# EAGLE design schematic (EAGLE 6.4)
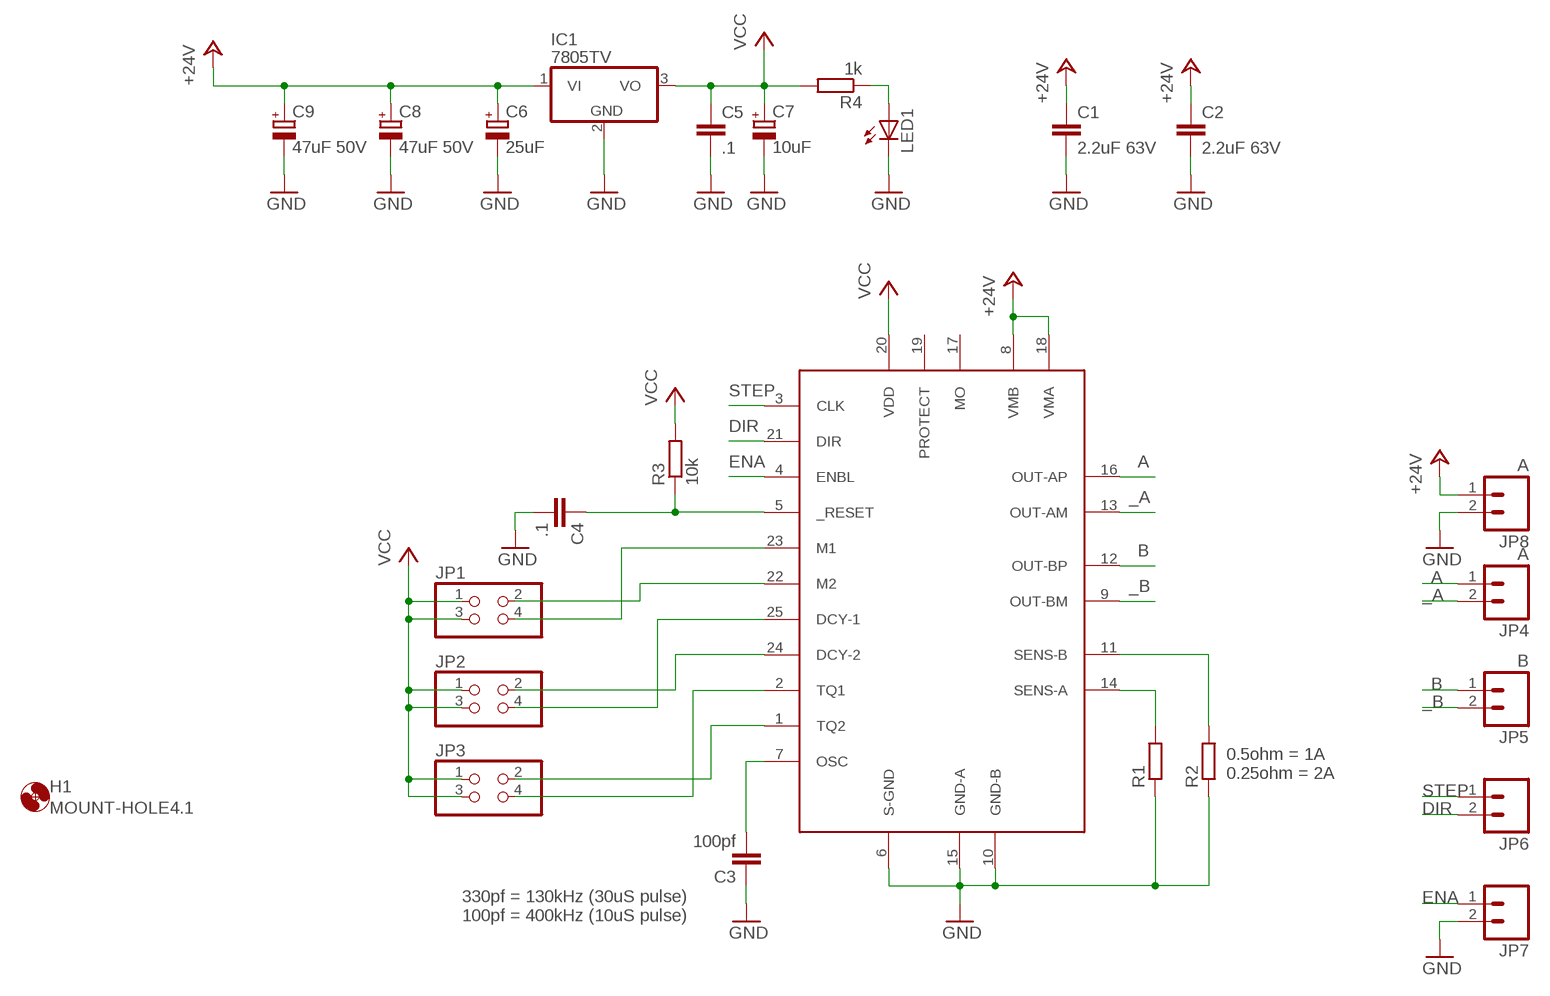
[diagram p0: schematic, sheet 1]

## Parts
C1  2.2uF 63V  C-EU225-108X268  [C225-108X268]
C2  2.2uF 63V  C-EU225-108X268  [C225-108X268]
C3  100pf  C-EUC0805K  [C0805K]
C4  .1  C-EUC0805K  [C0805K]
C5  .1  C-EUC0805K  [C0805K]
C6  25uF  CPOL-EUE2.5-5  [E2,5-5]
C7  10uF  CPOL-EUE2.5-5  [E2,5-5]
C8  47uF 50V  CPOL-EUE2.5-5  [E2,5-5]
C9  47uF 50V  CPOL-EUE2.5-5  [E2,5-5]
H1  MOUNT-HOLE4.1  [4,1]
IC1  7805TV  [TO220V]
JP1  PINHD-2X2  [2X02]
JP2  PINHD-2X2  [2X02]
JP3  PINHD-2X2  [2X02]
JP4  A  M02PTH4  [1X02_XTRA_BIG]
JP5  B  M02PTH4  [1X02_XTRA_BIG]
JP6  M02POGO_PIN_HOLES_ONLY  [1X02_PP_HOLES_ONLY]
JP7  M02POGO_PIN_HOLES_ONLY  [1X02_PP_HOLES_ONLY]
JP8  A  M02PTH4  [1X02_XTRA_BIG]
LED1  TLLG4400  [LED3MM]
R1  R-EU_0617/17  [0617/17]
R2  R-EU_0617/17  [0617/17]
R3  10k  R-EU_R0805  [R0805]
R4  1k  R-EU_R0805  [R0805]
U$1  TB6560-H  [ZIP25-H]

## Nets
+24V: C1.1 C2.1 C6.+ C8.+ C9.+ IC1.1(VI) JP8.1 U$1.8(VMB) U$1.18(VMA)
_A: JP4.2 U$1.13(OUT-AM)
_B: JP5.2 U$1.9(OUT-BM)
A: JP4.1 U$1.16(OUT-AP)
B: JP5.1 U$1.12(OUT-BP)
DIR: JP6.2 U$1.21(DIR)
ENA: JP7.1 U$1.4(ENBL)
GND: C1.2 C2.2 C3.1 C4.2 C5.2 C6.- C7.- C8.- C9.- IC1.2(GND) JP7.2 JP8.2 LED1.K(C) R1.1 R2.1 U$1.6(S-GND) U$1.10(GND-B) U$1.15(GND-A)
N$1: R1.2 U$1.14(SENS-A)
N$2: R2.2 U$1.11(SENS-B)
N$3: JP3.2 U$1.1(TQ2)
N$4: JP3.4 U$1.2(TQ1)
N$5: JP2.2 U$1.24(DCY-2)
N$6: JP2.4 U$1.25(DCY-1)
N$7: JP1.2 U$1.22(M2)
N$8: JP1.4 U$1.23(M1)
N$11: C4.1 R3.1 U$1.5(_RESET)
N$12: C3.2 U$1.7(OSC)
N$13: LED1.A R4.1
STEP: JP6.1 U$1.3(CLK)
VCC: C5.1 C7.+ IC1.3(VO) JP1.1 JP1.3 JP2.1 JP2.3 JP3.1 JP3.3 R3.2 R4.2 U$1.20(VDD)
Unconnected: U$1.17(MO) U$1.19(PROTECT)

## Notes on the sheet
- 0.5ohm = 1A
  0.25ohm = 2A
- 330pf = 130kHz (30uS pulse)
  100pf = 400kHz (10uS pulse)

## Library data of the parts
C1-C5 = rcl:C-EU: CAPACITOR, European symbol
C6-C9 = rcl:CPOL-EU: POLARIZED CAPACITOR, European symbol
H1 = holes:MOUNT-HOLE: MOUNTING HOLE with drill center marker
IC1 = linear:78*: Positive VOLTAGE REGULATOR Source: http://cache.national.com/ds/LM/LM78L05.pdf http://www.fairchildsemi.com/ds/LM/LM7805.pdf
JP1-JP3 = pinhead:PINHD-2X2: PIN HEADER
JP4-JP8 = SparkFun-Connectors:M02: Standard 2-pin 0.1" header. Use with - straight break away headers ( PRT-00116) - right angle break away headers (PRT-00553) - swiss pins (PRT-00743) - machine pins (PRT-00117) - female headers (PRT-00115) Molex polarized connector foot print use with: PRT-08233 with associated crimp pins and housings. 2.54_SCREWTERM for use with PRT-10571. 3.5mm Screw Terminal footprints for PRT-08084 5mm Screw Terminal footprints for use with PRT-08433
LED1 = led:TLLG4400: Low Current (2mA) LED 3 mm Tinted Diffused Package color GREEN Source: Data sheet <http://www.farnell.com/datasheets/391098.pdf>; MF: VISHAY SEMICONDUCTOR; OC_FARNELL: 1612435
R1-R4 = rcl:R-EU_: RESISTOR, European symbol
U$1 = tb6560:TB6560-H

## Board
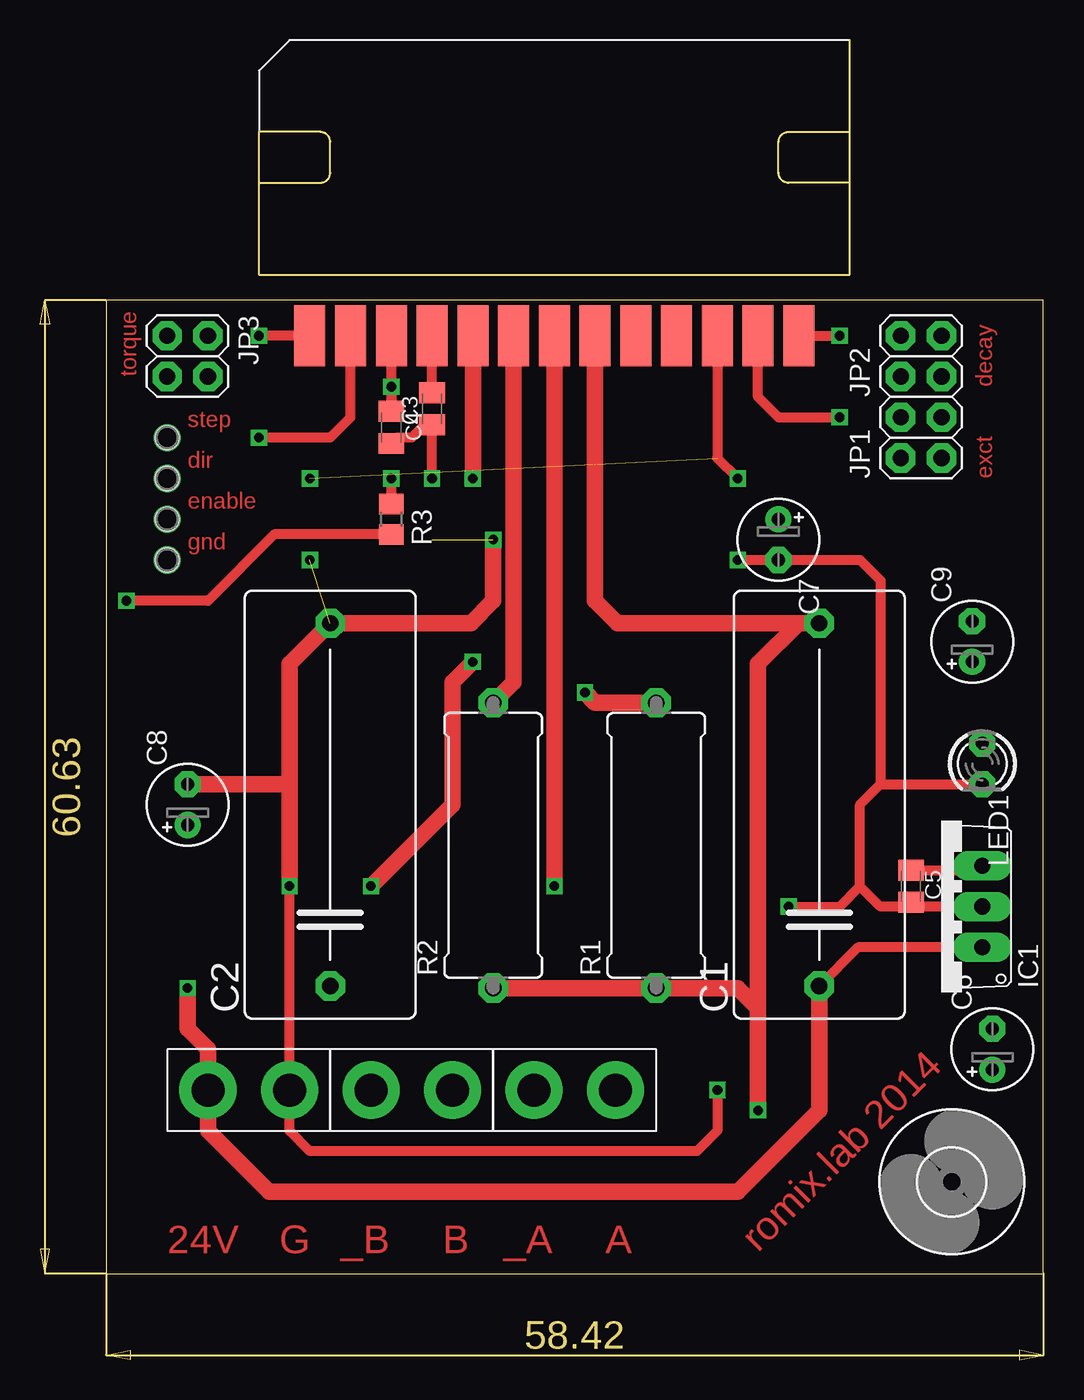
[diagram p1: board, top side]
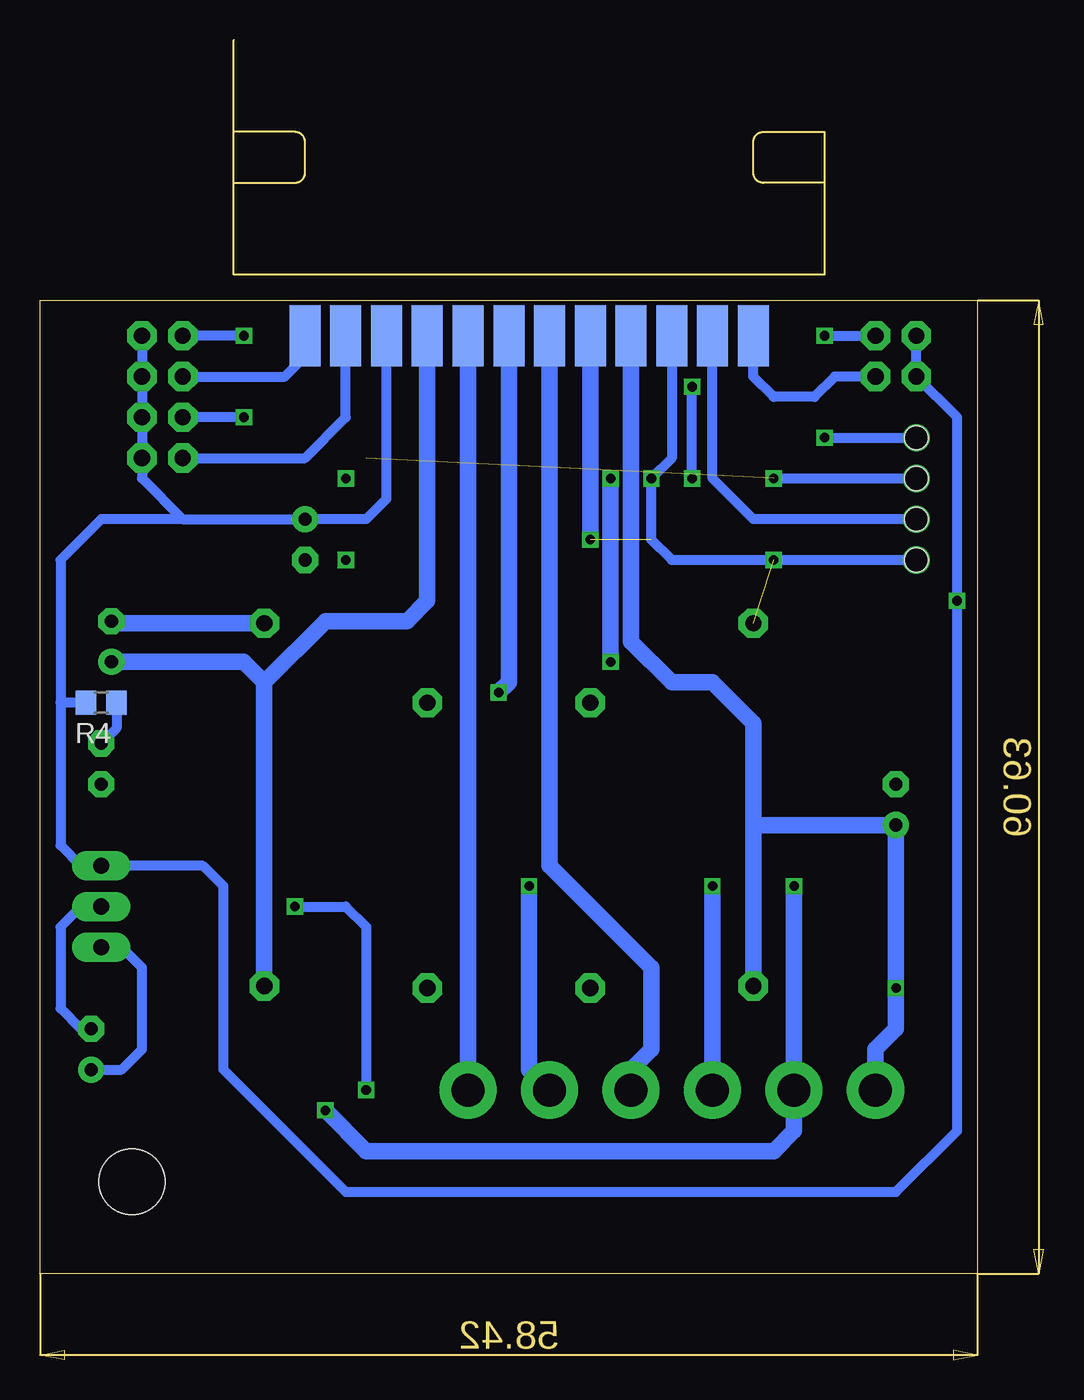
[diagram p2: board, bottom side, seen from below]

Size 58.4 x 60.63 mm. Coordinates in mm from the lower left corner, seen from the top.
Outline: 0,0 58.4,0 58.4,60.63 0,60.63 0,0
Copper layers (1*16): Top 0.035mm / dielectric 1.5mm / Bottom 0.035mm
Design rules "default *": minimum track width 12mil, minimum drill 32mil, track to track 12mil, track to pad 12mil, pad to pad 12mil, via to via 12mil, smd to smd 8mil, copper to edge 20mil, drill to drill 20mil, minimum pad ring 16mil, minimum via ring 8mil, stop-mask expansion 4mil, vias tented up to drill 0mil, thermal gap 10mil

### Footprints (pad centres in the part's own frame; a part is rotated, then mirrored left to right if it is on the bottom)
C225-108X268 = drill 1.016 octagon: 1 -11.303,0; 2 11.303,0
C0805K = smd 1.3 x 1.6: 1 -1,0; 2 1,0
E2,5-5 = drill 0.813 pad 1.6: + -1.27,0 | drill 0.813 pad 1.6 octagon: - 1.27,0
4,1 = hole 4.1: 0,0
TO220V = drill 1.016 long: 1 -2.54,-2.54; 2 0,-2.54; 3 2.54,-2.54
2X02 = drill 1.016 octagon: 1 -1.27,-1.27; 2 -1.27,1.27; 3 1.27,-1.27; 4 1.27,1.27
1X02_XTRA_BIG = drill 2.057 pad 3.556: 1 -2.54,0; 2 2.54,0
1X02_PP_HOLES_ONLY = drill 0.889 pad 0.813: 1 0,0; 2 2.54,0 | hole 1.473: 0,0; 2.54,0
LED3MM = drill 0.813 octagon: A -1.27,0; K 1.27,0
0617/17 = drill 1.016 octagon: 1 -8.89,0; 2 8.89,0
R0805 = smd 1.3 x 1.5: 1 -0.95,0; 2 0.95,0
ZIP25-H = smd 1.93 x 3.81: 1 2.54,-3.81; 3 5.08,-3.81; 5 7.62,-3.81; 7 10.16,-3.81; 9 12.7,-3.81; 11 15.24,-3.81; 13 17.78,-3.81; 15 20.32,-3.81; 17 22.86,-3.81; 19 25.4,-3.81; 21 27.94,-3.81; 23 30.48,-3.81; 25 33.02,-3.81 | smd 1.93 x 3.81 bottom: 2 3.81,-3.81; 4 6.35,-3.81; 6 8.89,-3.81; 8 11.43,-3.81; 10 13.97,-3.81; 12 16.51,-3.81; 14 19.05,-3.81; 16 21.59,-3.81; 18 24.13,-3.81; 20 26.67,-3.81; 22 29.21,-3.81; 24 31.75,-3.81

### Placement (x,y rotation side)
C1  44.45,29.21 90 top
C2  13.97,29.21 90 top
C3  20.32,53.87 90 top
C4  17.78,52.7 270 top
C5  50.16,24.13 270 top
C6  55.24,13.97 90 top
C7  41.91,45.72 270 top
C8  5.08,29.21 90 top
C9  53.98,39.37 90 top
H1  52.7,5.71 0 top
IC1  52.07,22.86 90 top
JP1  50.8,52.07 90 top
JP2  50.8,57.15 90 top
JP3  5.08,57.15 270 top
JP4  29.21,11.43 180 top
JP5  19.05,11.43 180 top
JP6  3.81,52.07 270 top
JP7  3.81,46.99 270 top
JP8  8.89,11.43 0 top
LED1  54.61,31.75 270 top
R1  34.29,26.67 90 top
R2  24.13,26.67 90 top
R3  17.78,46.99 270 top
R4  54.61,35.56 180 bottom
U$1  10.16,62.23 0 top

### Tracks (layer width: path | path; a pad name or v marks a point on that pad's centre or on a via)
+24V  (via drill 0.6)
  Top 0.61: IC1.1 46.86,20.32 C1.1
  Top 1.016: C1.1 44.45,10.16 39.37,5.08 10.16,5.08 6.35,8.89 JP8.1 6.35,13.97 5.08,15.24 v5.08,17.78
  Bottom 0.61: C6.+ 53.34,12.7 52.07,13.97 52.07,19.05 53.34,20.32 IC1.1
  Bottom 1.016: C1.1 44.45,36.83 | 44.45,36.83 40.64,40.64 35.56,40.64 34.29,41.91 U$1.18 | 13.97,27.94 C2.1 13.84,17.78 | 13.97,27.94 13.97,34.29 16.51,36.83 19.05,36.83 21.59,39.37 U$1.8 | C9.+ 45.72,38.1 44.45,36.83 | 13.97,27.94 C8.+ v5.08,17.78 | v5.08,17.78 5.08,19.05 | v5.08,17.78 5.08,15.24 6.35,13.97 JP8.1
_A  (via drill 0.6)
  Top 1.016: U$1.13 v27.94,24.13
  Bottom 1.016: v27.94,24.13 27.94,12.7 JP4.2
_B  (via drill 0.6)
  Top 1.016: v22.86,38.1 21.59,36.83 21.59,29.21 v16.51,24.13 | v22.86,49.53 U$1.9
  Bottom 1.016: v22.86,38.1 v22.86,49.53 | v16.51,24.13 JP5.2
A
  Bottom 1.016: JP4.1 U$1.16
B
  Bottom 1.016: JP5.1 21.59,12.7 20.32,13.97 20.32,19.05 26.67,25.4 U$1.12
DIR  (via drill 0.6)  (1 unrouted)
  Top 0.61: U$1.21 38.1,50.8 v39.37,49.53
  Bottom 0.61: v12.7,49.53 JP6.2
ENA
  Bottom 0.61: JP7.1 13.97,46.99 16.51,49.53 U$1.4
GND  (via drill 0.6)  (2 unrouted)
  Top 0.61: C4.2 18.14,52.07 19.05,52.07 19.95,52.97 20.21,52.97 C3.1 v20.32,49.53 | C5.2 50.44,22.86 IC1.2 48.26,22.86 46.99,24.13 | 46.99,24.13 46.99,29.21 48.26,30.48 | 48.26,30.48 LED1.K | v38.1,11.43 38.1,8.89 36.83,7.62 12.7,7.62 11.43,8.89 v11.43,24.13 | 48.26,30.48 48.26,43.18 46.99,44.45 C7.- v39.37,44.45 | v42.55,22.86 45.72,22.86 46.99,24.13
  Top 1.016: C1.2 43.18,40.51 | 43.18,40.51 31.88,40.51 30.48,41.91 U$1.15 | v24.13,45.72 24.13,41.91 22.73,40.51 C2.2 11.43,37.97 11.43,30.48 | 40.64,16.51 40.64,37.97 43.18,40.51 | 40.64,16.51 39.37,17.78 R1.1 R2.1 | v11.43,24.13 11.43,30.48 | 40.64,16.51 v40.64,10.16 | C8.- 11.43,30.48
  Bottom 0.61: U$1.6 19.05,50.8 v20.32,49.53 20.32,45.72 19.05,44.45 JP7.2 | IC1.2 55.88,22.86 57.15,21.59 57.15,16.51 55.88,15.24 C6.- | v42.55,22.86 39.37,22.86 38.1,21.59 v38.1,11.43
  Bottom 1.016: v24.13,45.72 U$1.10 | v11.43,24.13 JP8.2 11.43,8.89 12.7,7.62 38.1,7.62 v40.64,10.16 | C1.2 53.85,40.51 C9.-
  other vias: 12.7,44.45
N$1  (via drill 0.6)
  Top 1.016: R1.2 30.48,35.56 v29.84,36.2
  Bottom 1.016: v29.84,36.2 29.21,36.83 U$1.14
N$2
  Top 1.016: R2.2 25.4,36.83 U$1.11
N$3  (via drill 0.6)
  Top 0.61: U$1.1 v9.52,58.42
  Bottom 0.61: v9.52,58.42 JP3.2
N$4
  Bottom 0.61: JP3.4 8.89,55.88 10.16,54.61 12.7,54.61 13.97,55.88 U$1.2
N$5
  Bottom 0.61: JP2.2 43.18,55.88 41.91,57.15 U$1.24
N$6  (via drill 0.6)
  Top 0.61: U$1.25 v45.72,58.42
  Bottom 0.61: v45.72,58.42 JP2.4
N$7
  Bottom 0.61: JP1.2 41.91,50.8 39.37,53.34 U$1.22
N$8  (via drill 0.6)
  Top 0.61: U$1.23 40.64,54.61 41.91,53.34 v45.72,53.34
  Bottom 0.61: v45.72,53.34 JP1.4
N$11  (via drill 0.6)
  Top 0.61: R3.1 v17.78,49.53 | v17.78,55.25 C4.1 U$1.5
  Bottom 0.61: v17.78,49.53 v17.78,55.25
N$12
  Top 0.61: C3.2 U$1.7
N$13
  Bottom 0.61: R4.1 53.66,33.97 LED1.A
STEP  (via drill 0.6)
  Top 0.61: 15.24,59.06 U$1.3 15.24,53.34 13.97,52.07 v9.52,52.07
  Bottom 0.61: v9.52,52.07 JP6.1
VCC  (via drill 0.6)
  Top 0.61: C5.1 54.34,25.13 IC1.3 | R3.2 10.48,46.04 6.35,41.91 v1.27,41.91
  Bottom 0.61: JP2.3 JP2.1 JP1.3 JP1.1 52.07,49.53 49.53,46.99 | 49.53,46.99 54.61,46.99 57.15,44.45 57.15,35.56 | 57.15,35.56 57.15,26.67 55.88,25.4 IC1.3 48.26,25.4 46.99,24.13 46.99,12.7 39.37,5.08 5.08,5.08 1.27,8.89 v1.27,41.91 1.27,49.53 1.27,53.34 JP3.3 JP3.1 | R4.2 57.15,35.56 | 49.53,46.99 C7.+ 38.1,46.99 36.83,48.26 U$1.20

### Text on the board
Top: torque | decay | step | dir | exct | enable | gnd | 24V | G | _B | B | _A | A | romix.lab 2014